# EAGLE design mcu_adapter (EAGLE 9.7.0)
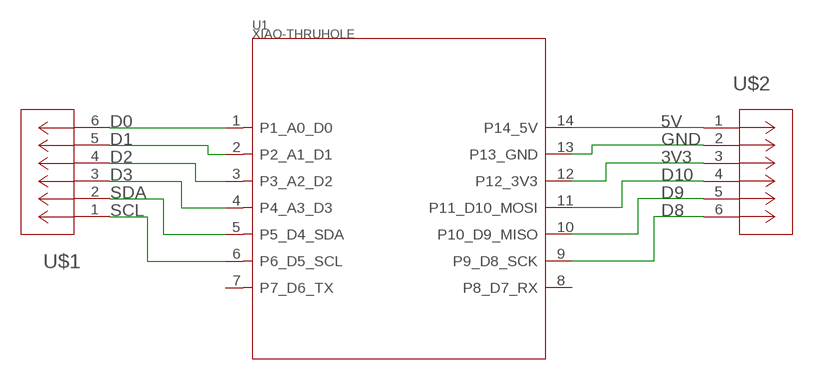
[diagram p0: schematic, sheet 1]

## Parts
U1  XIAO-THRUHOLE  [XIAO-GENERIC-THRUHOLE-MODULE14P-2.54-21X17.8MM]
U$1  NRPN032PAEN-RC  [CONN3X2_NRPN032PAEN-RC]
U$2  NRPN032PAEN-RC  [CONN3X2_NRPN032PAEN-RC]

## Nets
3V3: U1.12(P12_3V3) U$2.3
5V: U1.14(P14_5V) U$2.1
D0: U1.1(P1_A0_D0) U$1.6
D1: U1.2(P2_A1_D1) U$1.5
D2: U1.3(P3_A2_D2) U$1.4
D3: U1.4(P4_A3_D3) U$1.3
D8: U1.9(P9_D8_SCK) U$2.6
D9: U1.10(P10_D9_MISO) U$2.5
D10: U1.11(P11_D10_MOSI) U$2.4
GND: U1.13(P13_GND) U$2.2
SCL: U1.6(P6_D5_SCL) U$1.1
SDA: U1.5(P5_D4_SDA) U$1.2
Unconnected: U1.7(P7_D6_TX) U1.8(P8_D7_RX)

## Library data of the parts
U1 = Seeed Studio XIAO Series:XIAO-THRUHOLE: Seeed Studio XIAO Series Through-hole Footprint and Symbol Basic through-hole footprint for Seeed XIAO series of boards. The underside surface mount pads are disabled. For through-hole mounting, a pair of 7-pin, 2.54mm pitch headers with 0.64x0.64mm square leads are recommended. The hybrid variant allows the assembler to choose between surface mount and through-hole mounting methods. However, there is a risk of solder leakage and therefore insufficient solder at the joints if soldering using solder paste and stencils, so we advise using this footprint only when the module is intended to be hand soldered. The symbol pin labels are generic. Please refer to the specific board for more information. Seeed Studio XIAO SAMD21 (Seeeduino XIAO) is also available pre-soldered: Seeed Studio XIAO SAMD21 Pre-soldered - Microchip ATSAMD21G18 Arduino Microcontroller with headers Seeed SKU: 102010388 Buy now <https://www.seeedstudio.com/Seeeduino-XIAO-Pre-Soldered-p-4747.html>
U$1 U$2 = NPPN032AFCN-RC:NRPN032PAEN-RC

## Board
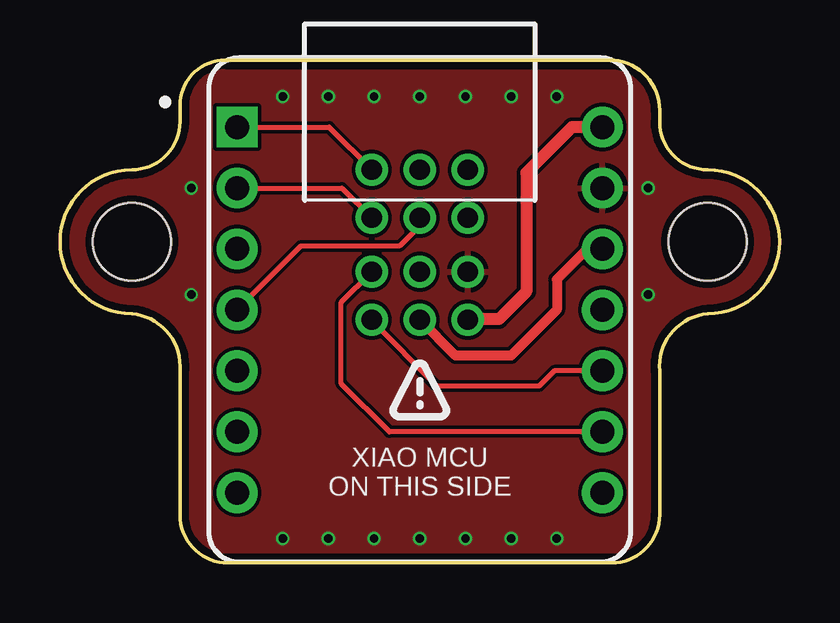
[diagram p1: board, top side]
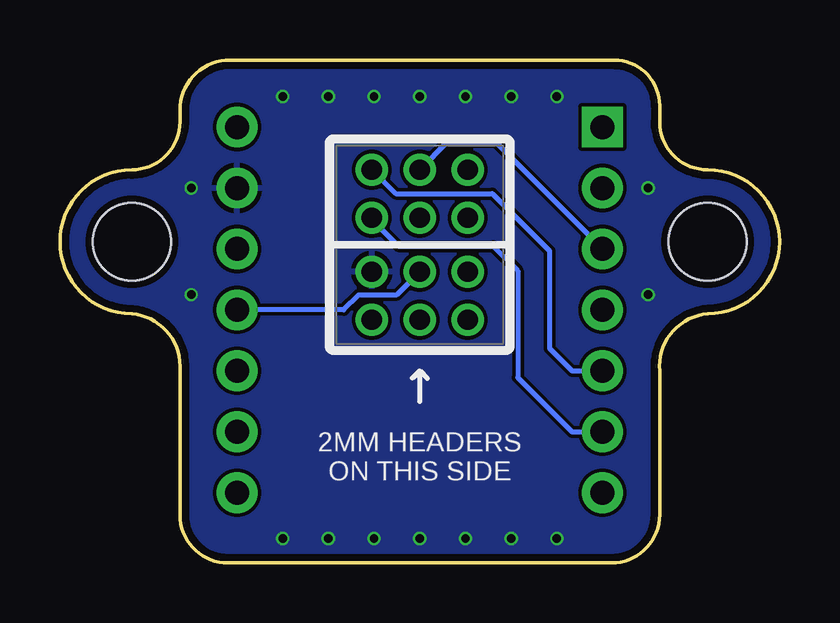
[diagram p2: board, bottom side, seen from below]

Size 30 x 20.96 mm. Coordinates in mm from the lower left corner, seen from the top.
Outline: 5,2 5,8 arc90 3,10.38 arc-180 3,16.38 arc90 5,18.38 5,19.05 arc-90 6.9,20.96 22.9,20.96 arc-90 25,18.86 25,18.38 arc90 27,16.38 arc-180 27,10.38 arc90 25,8 25,2 arc-90 23,0 7,0 arc-90 5,2
Copper layers (1*16): Top 0.035mm / dielectric 1.5mm / Bottom 0.035mm
Design rules "PCBWay_2L_152um-Track.dru": minimum track width 6mil, minimum drill 0.3mm, track to track 6mil, track to pad 6mil, pad to pad 6mil, via to via 6mil, smd to smd 0mil, copper to edge 0.3mm, drill to drill 10mil, minimum pad ring 6mil, minimum via ring 0.1mm, stop-mask expansion 2mil, vias tented up to drill 0.45mm, thermal gap 0.2mm
Holes 3.25 mm at 3,13.38 27,13.38

### Footprints (pad centres in the part's own frame; a part is rotated, then mirrored left to right if it is on the bottom)
XIAO-GENERIC-THRUHOLE-MODULE14P-2.54-21X17.8MM = drill 1 pad 1.7 square: 1 -7.62,7.62 | drill 1 pad 1.7: 2 -7.62,5.08; 3 -7.62,2.54; 4 -7.62,0; 5 -7.62,-2.54; 6 -7.62,-5.08; 7 -7.62,-7.62; 8 7.62,-7.62; 9 7.62,-5.08; 10 7.62,-2.54; 11 7.62,0; 12 7.62,2.54; 13 7.62,5.08; 14 7.62,7.62
CONN3X2_NRPN032PAEN-RC = drill 0.838 pad 1.346: 1 2,1; 2 2,-1; 3 0,1; 4 0,-1; 5 -2,1; 6 -2,-1

### Placement (x,y rotation side)
U1  15,10.54 0 top
U$1  15,15.38 180 bottom
U$2  15,11.13 180 bottom

### Tracks (layer width: path | path; a pad name or v marks a point on that pad's centre or on a via)
3V3
  Top 0.406: U1.12 21.98,13.08 20.71,11.81 20.71,10.54 18.81,8.64 16.5,8.64 U$2.3
5V
  Top 0.508: U1.14 21.35,18.16 19.45,16.26 19.45,11.3 18.3,10.16 17.03,10.16 U$2.1
D0
  Top 0.203: U1.1 11.22,18.16 U$1.6
D1
  Top 0.203: U1.2 11.76,15.62 U$1.5
D2
  Bottom 0.203: U1.3 10.68,16.38 11.82,17.53 13.86,17.53 U$1.4
D3
  Top 0.203: U$1.3 15,14.05 14.15,13.2 10.04,13.2 U1.4
D8
  Top 0.203: U1.9 13.73,5.46 11.72,7.47 11.72,10.85 U$2.6
D9
  Top 0.203: U1.10 20.61,8 19.98,7.37 15.71,7.37 13,10.08 U$2.5
D10
  Bottom 0.203: U$2.4 15.97,11.16 17.56,11.16 18.18,10.54 U1.11
GND  (via drill 0.35)
  other vias: 9.29,19.43 11.19,19.43 13.1,19.43 15,19.43 16.91,19.43 18.81,19.43 20.71,19.43 9.29,1.02 11.19,1.02 13.1,1.02 15,1.02 16.91,1.02 18.81,1.02 20.71,1.02 5.47,15.62 5.47,11.18 24.52,15.62 24.52,11.18
  pour Top: -0.8,-1.45 30.8,-1.45 30.8,21.89 -0.8,21.89
  pour Bottom: -1.43,-2.08 31.43,-2.08 31.43,22.53 -1.43,22.53
SCL
  Bottom 0.203: U$1.1 17,14.31 15.89,13.2 11.94,13.2 10.91,12.17 10.91,7.72 8.65,5.46 U1.6
SDA
  Bottom 0.203: U1.5 8.65,8 9.59,8.94 9.59,13.01 11.97,15.38 16,15.38 U$1.2

### Text on the board
tPlace: XIAO MCU / ON THIS SIDE
bPlace: 2MM HEADERS / ON THIS SIDE